# EAGLE design delete-me (EAGLE 5.11)
DRAWN_BY: Alexios; PROJECT_NAME: CFT Mini-Computer; REVISION: Rev B; SHEET_DESCRIPTION: Major Registers: Program Counter (PC); SIMULATION_FILENAME: register.v#reg_pc; URL: http://www.bedroomlan.org/cft

## Sheet 1 of 3
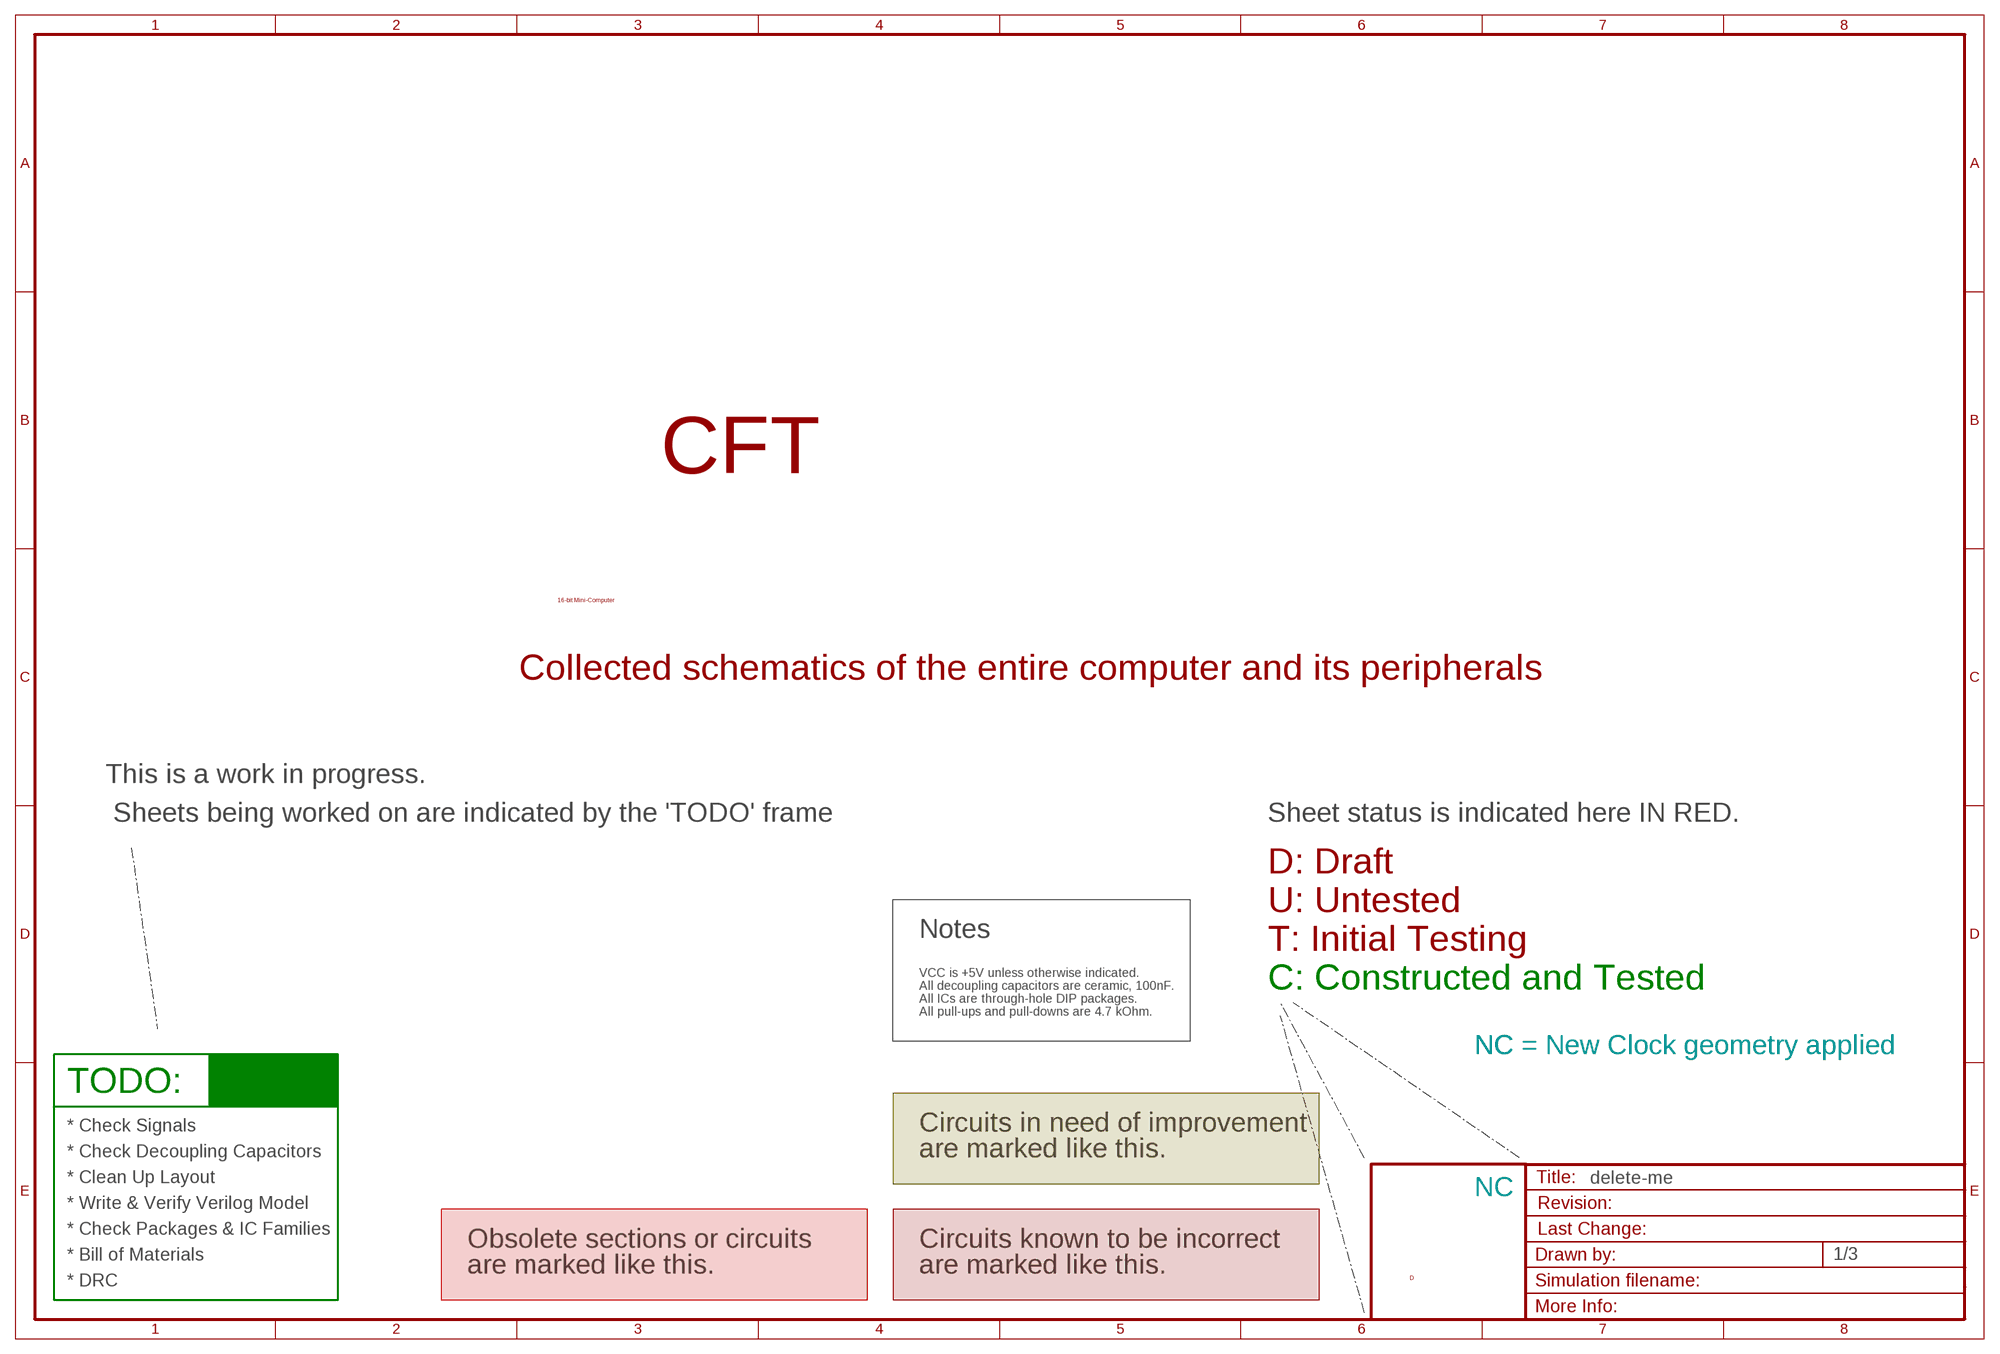
[diagram p0: schematic, sheet 1]

### Notes on the sheet
- CFT
- 16-bit Mini-Computer
- Collected schematics of the entire computer and its peripherals
- This is a work in progress.
- Sheets being worked on are indicated by the 'TODO' frame | Sheet status is indicated here IN RED.
- D: Draft
- U: Untested
- Notes
- T: Initial Testing
- VCC is +5V unless otherwise indicated.
- All decoupling capacitors are ceramic, 100nF. | C: Constructed and Tested
- All ICs are through-hole DIP packages.
- All pull-ups and pull-downs are 4.7 kOhm.
- NC | NC = New Clock geometry applied
- TODO:
- * Check Signals | Circuits in need of improvement
- * Check Decoupling Capacitors | are marked like this.
- * Clean Up Layout
- NC
- * Write & Verify Verilog Model
- * Check Packages & IC Families
- Obsolete sections or circuits | Circuits known to be incorrect
- * Bill of Materials
- are marked like this. | are marked like this.
- D
- * DRC

## Sheet 2 of 3
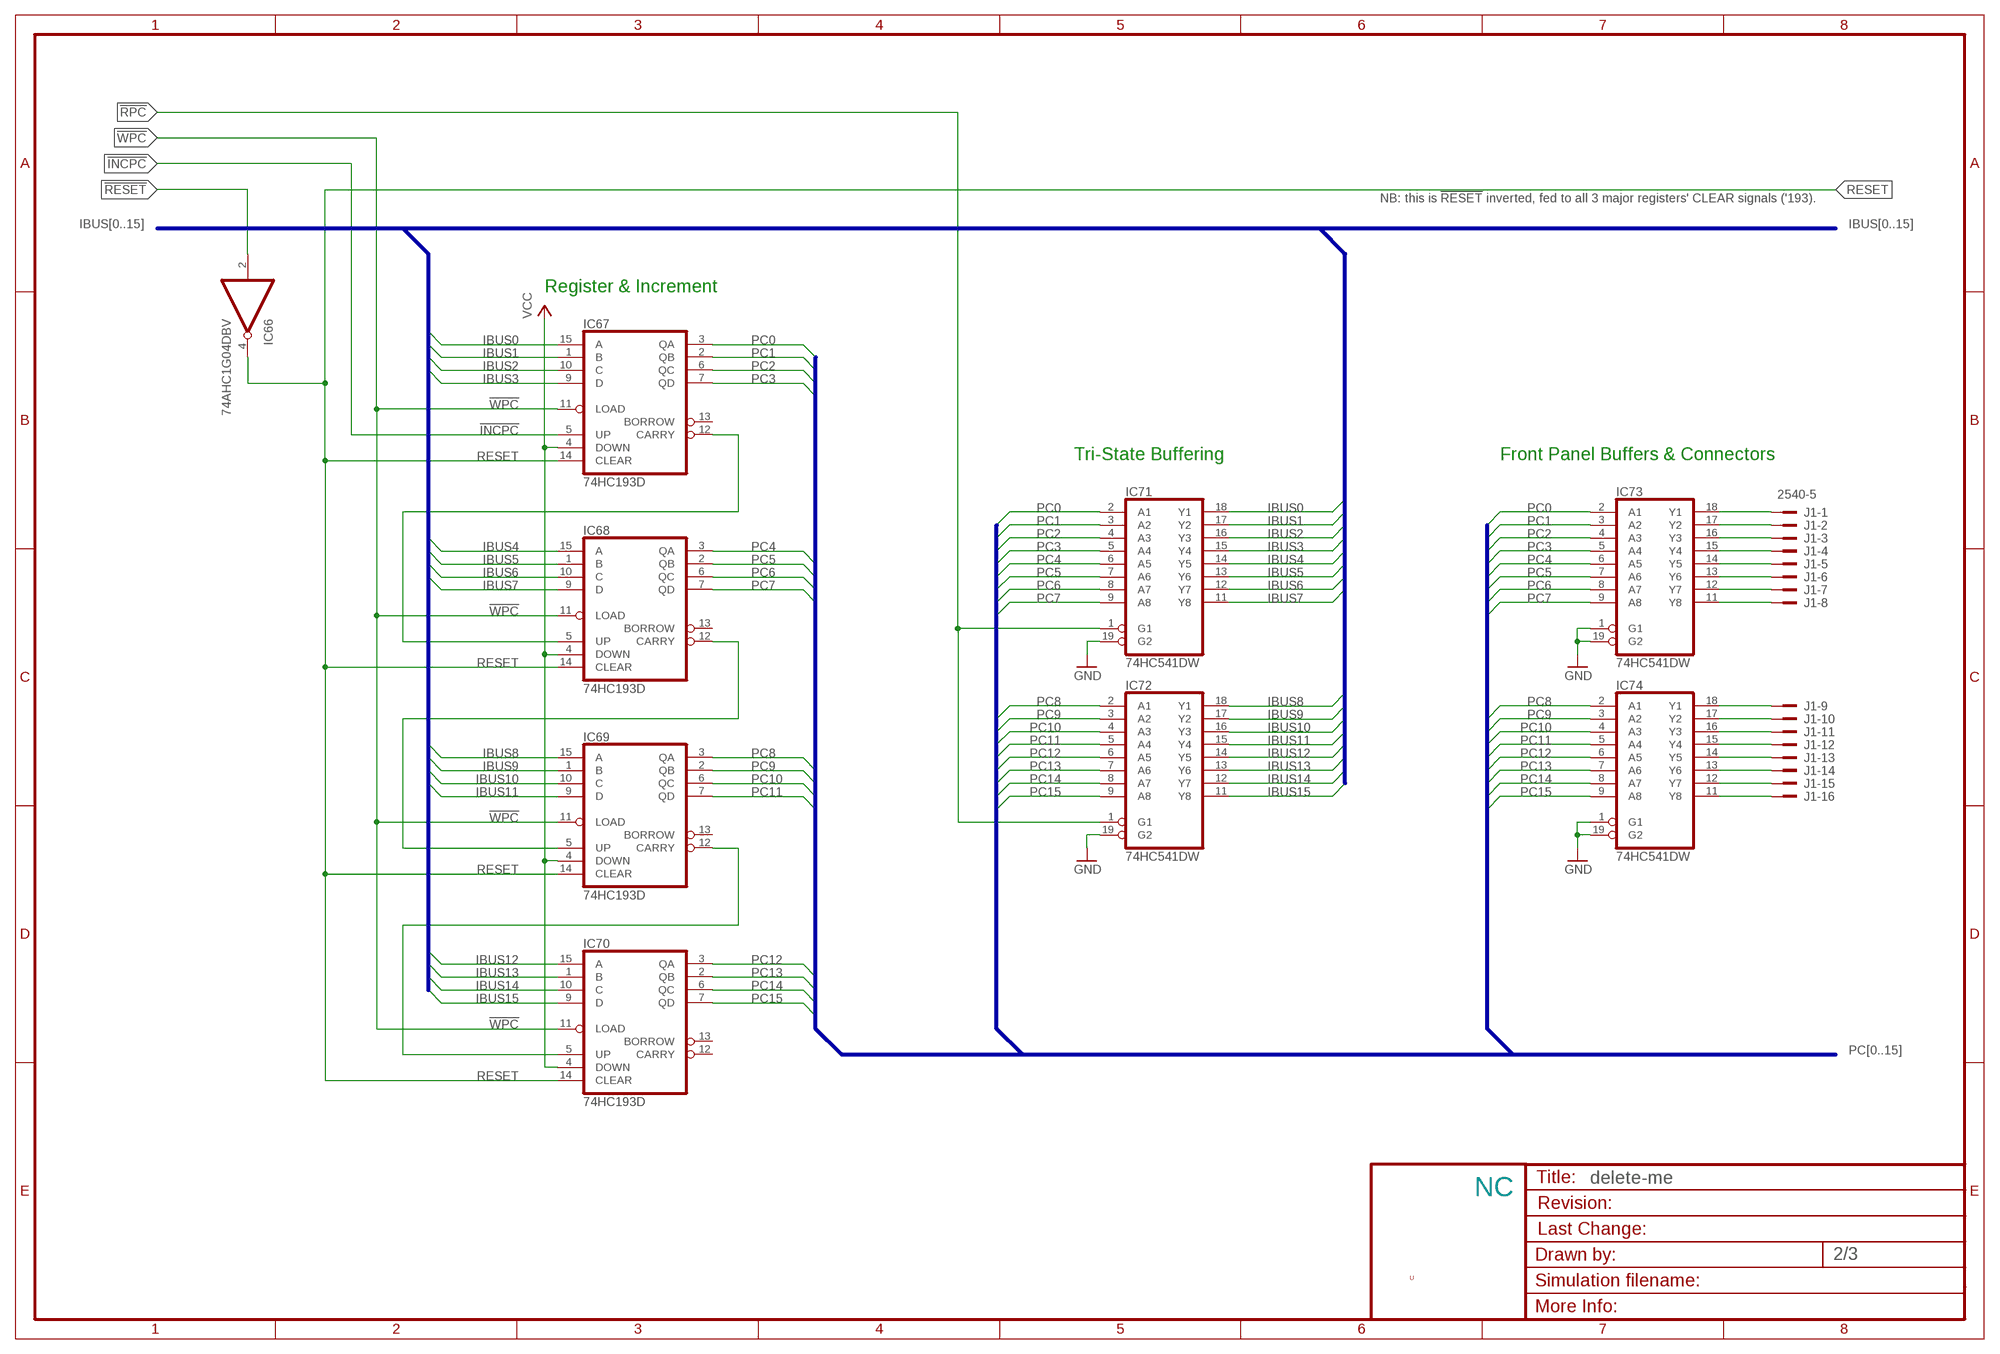
[diagram p1: schematic, sheet 2]

### Parts
IC66  74AHC1G04DBV  [SOT23-5]
IC67  74HC193D  [SO16D]
IC68  74HC193D  [SO16D]
IC69  74HC193D  [SO16D]
IC70  74HC193D  [SO16D]
IC71  74HC541DW  [SO20W]
IC72  74HC541DW  [SO20W]
IC73  74HC541DW  [SO20W]
IC74  74HC541DW  [SO20W]
J1  2540-5  [PAK100/2500-5-40]

### Nets
!INCPC: IC67.5(UP) ; also sheet 3
!RESET: IC66.2(I) ; also sheet 3
!RPC: IC71.1(G1) IC72.1(G1) ; also sheet 3
!WPC: IC67.11(LOAD) IC68.11(LOAD) IC69.11(LOAD) IC70.11(LOAD) ; also sheet 3
GND [low power]: IC71.19(G2) IC72.19(G2) IC73.1(G1) IC73.19(G2) IC74.1(G1) IC74.19(G2) ; also sheet 3
IBUS0: IC67.15(A) IC71.18(Y1) ; also sheet 3
IBUS1: IC67.1(B) IC71.17(Y2) ; also sheet 3
IBUS2: IC67.10(C) IC71.16(Y3) ; also sheet 3
IBUS3: IC67.9(D) IC71.15(Y4) ; also sheet 3
IBUS4: IC68.15(A) IC71.14(Y5) ; also sheet 3
IBUS5: IC68.1(B) IC71.13(Y6) ; also sheet 3
IBUS6: IC68.10(C) IC71.12(Y7) ; also sheet 3
IBUS7: IC68.9(D) IC71.11(Y8) ; also sheet 3
IBUS8: IC69.15(A) IC72.18(Y1) ; also sheet 3
IBUS9: IC69.1(B) IC72.17(Y2) ; also sheet 3
IBUS10: IC69.10(C) IC72.16(Y3) ; also sheet 3
IBUS11: IC69.9(D) IC72.15(Y4) ; also sheet 3
IBUS12: IC70.15(A) IC72.14(Y5) ; also sheet 3
IBUS13: IC70.1(B) IC72.13(Y6) ; also sheet 3
IBUS14: IC70.10(C) IC72.12(Y7) ; also sheet 3
IBUS15: IC70.9(D) IC72.11(Y8) ; also sheet 3
N$70: IC67.12(CARRY) IC68.5(UP)
N$71: IC68.12(CARRY) IC69.5(UP)
N$734: IC69.12(CARRY) IC70.5(UP)
N$736: IC73.18(Y1) J1.1
N$737: IC73.17(Y2) J1.2
N$738: IC73.16(Y3) J1.3
N$740: IC73.15(Y4) J1.4
N$741: IC73.14(Y5) J1.5
N$742: IC73.13(Y6) J1.6
N$743: IC73.12(Y7) J1.7
N$744: IC73.11(Y8) J1.8
N$745: IC74.18(Y1) J1.9
N$746: IC74.17(Y2) J1.10
N$747: IC74.16(Y3) J1.11
N$748: IC74.15(Y4) J1.12
N$749: IC74.14(Y5) J1.13
N$750: IC74.13(Y6) J1.14
N$751: IC74.12(Y7) J1.15
N$752: IC74.11(Y8) J1.16
PC0: IC67.3(QA) IC71.2(A1) IC73.2(A1)
PC1: IC67.2(QB) IC71.3(A2) IC73.3(A2)
PC2: IC67.6(QC) IC71.4(A3) IC73.4(A3)
PC3: IC67.7(QD) IC71.5(A4) IC73.5(A4)
PC4: IC68.3(QA) IC71.6(A5) IC73.6(A5)
PC5: IC68.2(QB) IC71.7(A6) IC73.7(A6)
PC6: IC68.6(QC) IC71.8(A7) IC73.8(A7)
PC7: IC68.7(QD) IC71.9(A8) IC73.9(A8)
PC8: IC69.3(QA) IC72.2(A1) IC74.2(A1)
PC9: IC69.2(QB) IC72.3(A2) IC74.3(A2)
PC10: IC69.6(QC) IC72.4(A3) IC74.4(A3) ; also sheet 3
PC11: IC69.7(QD) IC72.5(A4) IC74.5(A4) ; also sheet 3
PC12: IC70.3(QA) IC72.6(A5) IC74.6(A5) ; also sheet 3
PC13: IC70.2(QB) IC72.7(A6) IC74.7(A6) ; also sheet 3
PC14: IC70.6(QC) IC72.8(A7) IC74.8(A7) ; also sheet 3
PC15: IC70.7(QD) IC72.9(A8) IC74.9(A8) ; also sheet 3
RESET: IC66.4(O) IC67.14(CLEAR) IC68.14(CLEAR) IC69.14(CLEAR) IC70.14(CLEAR)
VCC [low power]: IC67.4(DOWN) IC68.4(DOWN) IC69.4(DOWN) IC70.4(DOWN) ; also sheet 3
Unconnected: IC67.13(BORROW) IC68.13(BORROW) IC69.13(BORROW) IC70.12(CARRY) IC70.13(BORROW) J1.17 J1.18 J1.19 J1.20 J1.21 J1.22 J1.23 J1.24 J1.25 J1.26 J1.27 J1.28 J1.29 J1.30 J1.31 J1.32

### Buses
IBUS[0..15]
PC[0..15]

### Notes on the sheet
- NB: this is !RESET! inverted, fed to all 3 major registers' CLEAR signals ('193).
- Register & Increment
- Tri-State Buffering | Front Panel Buffers & Connectors
- NC
- U

## Sheet 3 of 3
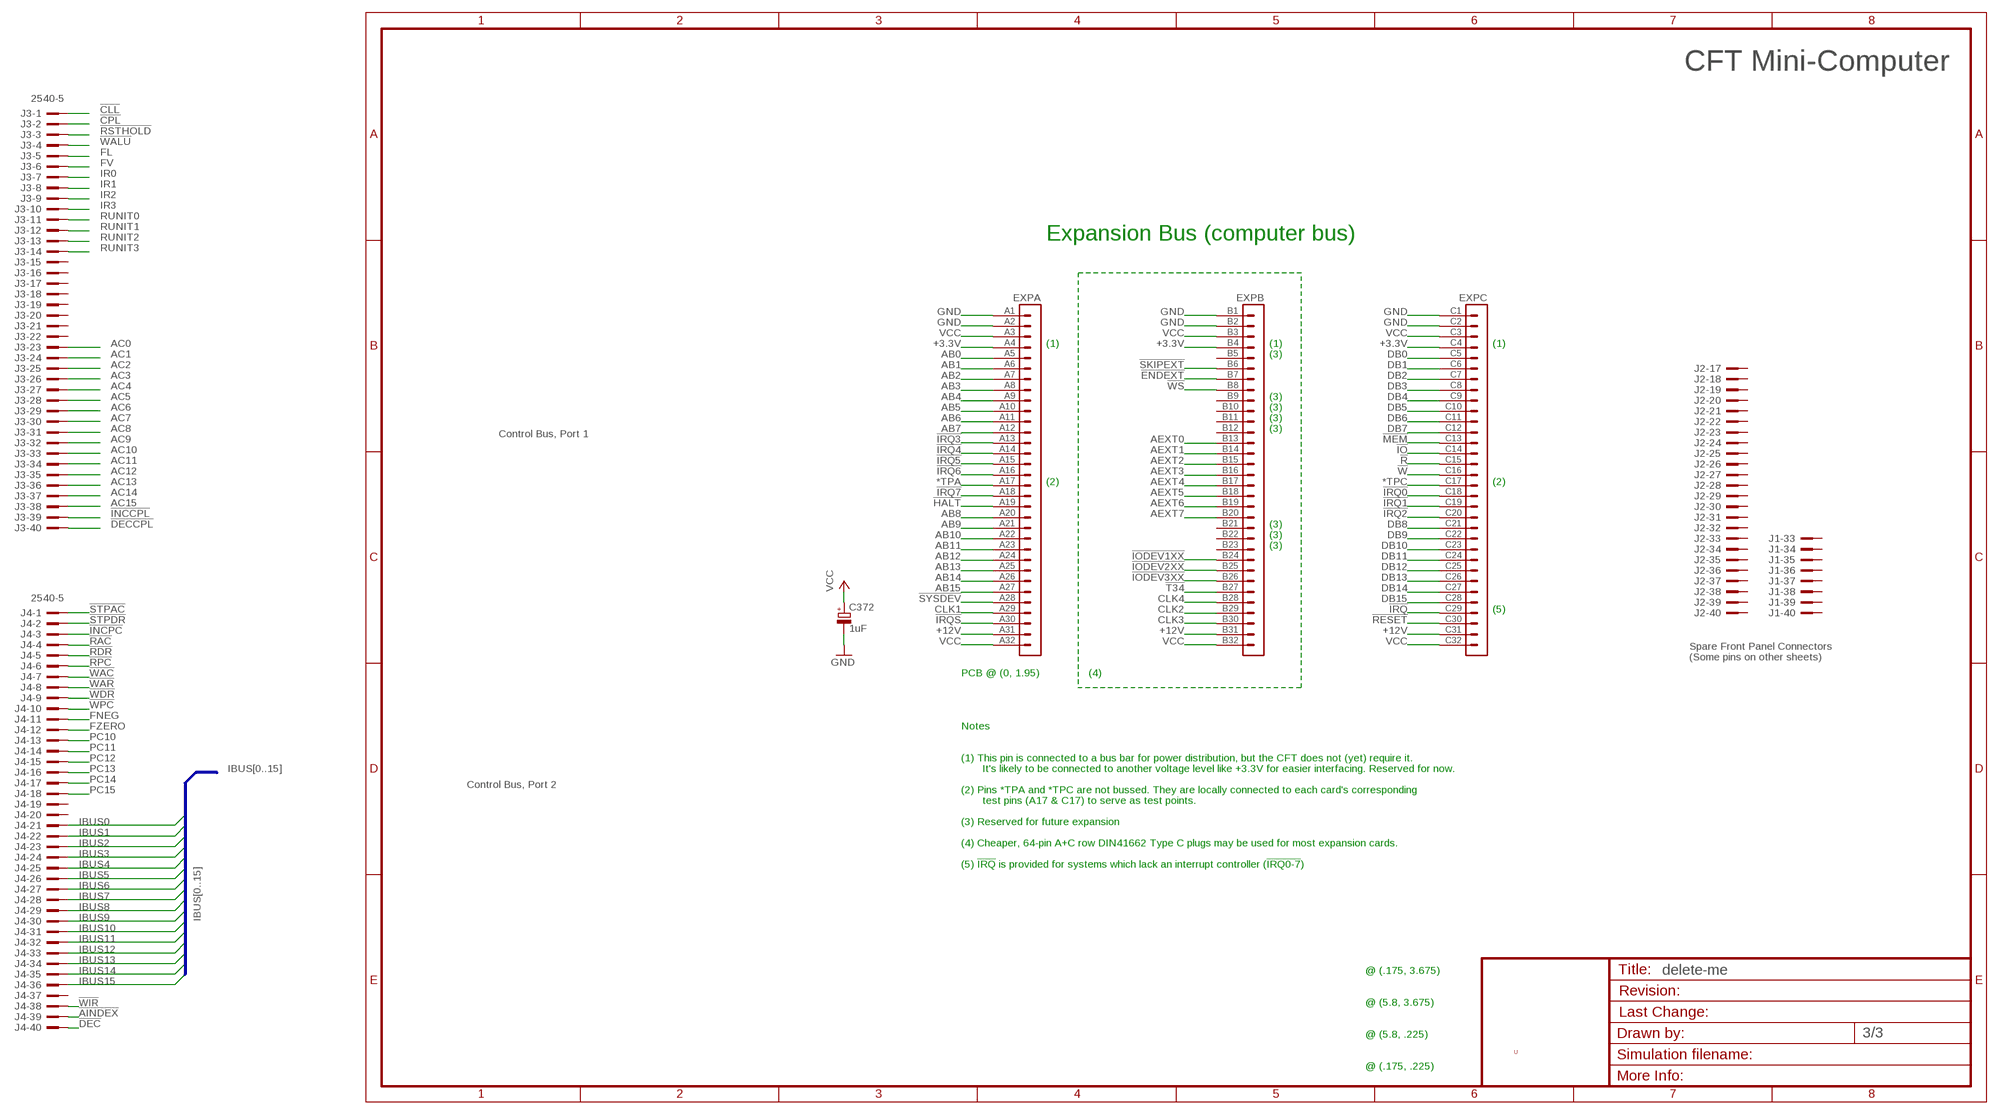
[diagram p2: schematic, sheet 3]

### Parts
C372  1uF  CPOL-EUE2.5-5  [E2,5-5]
EXP  VG96-3K  [VG96K]
J2  2540-5  [PAK100/2500-5-40]
J3  2540-5  [PAK100/2500-5-40]
J4  2540-5  [PAK100/2500-5-40]

### Nets
!AINDEX: J4.39
!CLL: J3.1
!CPL: J3.2
!DEC: J4.40
!DECCPL: J3.40
!ENDEXT: EXP.B7
!HALT: EXP.A19
!INCCPL: J3.39
!INCPC: J4.3 ; also sheet 2
!IO: EXP.C14
!IODEV1XX: EXP.B24
!IODEV2XX: EXP.B25
!IODEV3XX: EXP.B26
!IRQ: EXP.C29
!IRQ0: EXP.C18
!IRQ1: EXP.C19
!IRQ2: EXP.C20
!IRQ3: EXP.A13
!IRQ4: EXP.A14
!IRQ5: EXP.A15
!IRQ6: EXP.A16
!IRQ7: EXP.A18
!IRQS: EXP.A30
!MEM: EXP.C13
!R: EXP.C15
!RAC: J4.4
!RDR: J4.5
!RESET: EXP.C30 ; also sheet 2
!RPC: J4.6 ; also sheet 2
!RSTHOLD: J3.3
!SKIPEXT: EXP.B6
!STPAC: J4.1
!STPDR: J4.2
!SYSDEV: EXP.A28
!T34: EXP.B27
!W: EXP.C16
!WAC: J4.7
!WALU: J3.4
!WAR: J4.8
!WDR: J4.9
!WIR: J4.38
!WPC: J4.10 ; also sheet 2
!WS: EXP.B8
*TPA: EXP.A17
*TPC: EXP.C17
+3.3V: EXP.A4 EXP.B4 EXP.C4
+12V [LED power]: EXP.A31 EXP.B31 EXP.C31
AB0: EXP.A5
AB1: EXP.A6
AB2: EXP.A7
AB3: EXP.A8
AB4: EXP.A9
AB5: EXP.A10
AB6: EXP.A11
AB7: EXP.A12
AB8: EXP.A20
AB9: EXP.A21
AB10: EXP.A22
AB11: EXP.A23
AB12: EXP.A24
AB13: EXP.A25
AB14: EXP.A26
AB15: EXP.A27
AC0: J3.23
AC1: J3.24
AC2: J3.25
AC3: J3.26
AC4: J3.27
AC5: J3.28
AC6: J3.29
AC7: J3.30
AC8: J3.31
AC9: J3.32
AC10: J3.33
AC11: J3.34
AC12: J3.35
AC13: J3.36
AC14: J3.37
AC15: J3.38
AEXT0: EXP.B13
AEXT1: EXP.B14
AEXT2: EXP.B15
AEXT3: EXP.B16
AEXT4: EXP.B17
AEXT5: EXP.B18
AEXT6: EXP.B19
AEXT7: EXP.B20
CLK1: EXP.A29
CLK2: EXP.B29
CLK3: EXP.B30
CLK4: EXP.B28
DB0: EXP.C5
DB1: EXP.C6
DB2: EXP.C7
DB3: EXP.C8
DB4: EXP.C9
DB5: EXP.C10
DB6: EXP.C11
DB7: EXP.C12
DB8: EXP.C21
DB9: EXP.C22
DB10: EXP.C23
DB11: EXP.C24
DB12: EXP.C25
DB13: EXP.C26
DB14: EXP.C27
DB15: EXP.C28
FL: J3.5
FNEG: J4.11
FV: J3.6
FZERO: J4.12
GND [low power]: C372.- EXP.A1 EXP.A2 EXP.B1 EXP.B2 EXP.C1 EXP.C2 ; also sheet 2
IBUS0: J4.21 ; also sheet 2
IBUS1: J4.22 ; also sheet 2
IBUS2: J4.23 ; also sheet 2
IBUS3: J4.24 ; also sheet 2
IBUS4: J4.25 ; also sheet 2
IBUS5: J4.26 ; also sheet 2
IBUS6: J4.27 ; also sheet 2
IBUS7: J4.28 ; also sheet 2
IBUS8: J4.29 ; also sheet 2
IBUS9: J4.30 ; also sheet 2
IBUS10: J4.31 ; also sheet 2
IBUS11: J4.32 ; also sheet 2
IBUS12: J4.33 ; also sheet 2
IBUS13: J4.34 ; also sheet 2
IBUS14: J4.35 ; also sheet 2
IBUS15: J4.36 ; also sheet 2
IR0: J3.7
IR1: J3.8
IR2: J3.9
IR3: J3.10
PC10: J4.13 ; also sheet 2
PC11: J4.14 ; also sheet 2
PC12: J4.15 ; also sheet 2
PC13: J4.16 ; also sheet 2
PC14: J4.17 ; also sheet 2
PC15: J4.18 ; also sheet 2
RUNIT0: J3.11
RUNIT1: J3.12
RUNIT2: J3.13
RUNIT3: J3.14
VCC [low power]: C372.+ EXP.A3 EXP.A32 EXP.B3 EXP.B32 EXP.C3 EXP.C32 ; also sheet 2
Unconnected: EXP.B5 EXP.B9 EXP.B10 EXP.B11 EXP.B12 EXP.B21 EXP.B22 EXP.B23 J1.33 J1.34 J1.35 J1.36 J1.37 J1.38 J1.39 J1.40 J2.1 J2.2 J2.3 J2.4 J2.5 J2.6 J2.7 J2.8 J2.9 J2.10 J2.11 J2.12 J2.13 J2.14 J2.15 J2.16 J2.17 J2.18 J2.19 J2.20 J2.21 J2.22 J2.23 J2.24 J2.25 J2.26 J2.27 J2.28 J2.29 J2.30 J2.31 J2.32 J2.33 J2.34 J2.35 J2.36 J2.37 J2.38 J2.39 J2.40 J3.15 J3.16 J3.17 J3.18 J3.19 J3.20 J3.21 J3.22 J4.19 J4.20 J4.37

### Buses
IBUS[0..15]

### Notes on the sheet
- CFT Mini-Computer
- Expansion Bus (computer bus)
- (1) | (1) | (1)
- (3)
- (3)
- (3)
- (3)
- (3)
- Control Bus, Port 1
- (2) | (2)
- (3)
- (3)
- (3)
- (5)
- Spare Front Panel Connectors
- (Some pins on other sheets)
- PCB @ (0, 1.95) | (4)
- Notes
- (1) This pin is connected to a bus bar for power distribution, but the CFT does not (yet) require it.
- It's likely to be connected to another voltage level like +3.3V for easier interfacing. Reserved for now.
- Control Bus, Port 2
- (2) Pins *TPA and *TPC are not bussed. They are locally connected to each card's corresponding
- test pins (A17 & C17) to serve as test points.
- (3) Reserved for future expansion
- (4) Cheaper, 64-pin A+C row DIN41662 Type C plugs may be used for most expansion cards.
- (5) !IRQ! is provided for systems which lack an interrupt controller (!IRQ0-7!)
- @ (.175, 3.675)
- @ (5.8, 3.675)
- @ (5.8, .225)
- U
- @ (.175, .225)

## Power pins joined to a net without a drawn wire
GND: IC66.3(GND) IC67.8(GND) IC68.8(GND) IC69.8(GND) IC70.8(GND) IC71.10(GND) IC72.10(GND) IC73.10(GND) IC74.10(GND)
VCC: IC66.5(VCC) IC67.16(VCC) IC68.16(VCC) IC69.16(VCC) IC70.16(VCC) IC71.20(VCC) IC72.20(VCC) IC73.20(VCC) IC74.20(VCC)

## Library data of the parts
C372 = rcl:CPOL-EU: POLARIZED CAPACITOR, European symbol
EXP = alexios-19inch:VG96-3: PCB EUROCARD, 96-pin type C/ABC, 2.54 mm
IC66 = alexios:74*1G04: INVERTER Gate
IC67-IC70 = alexios:74*193: Presettable Synchronous Binary Up/Down Counter Up/down 4-bit binary counter with load and clear inputs, and borrow and carry outputs. Farnell description: <http://uk.farnell.com/nxp/74hct193n/ic-74hct-cmos-74hct193-dip16-5v/dp/382218> Order Code: 382218 Manufacturer Part No: 74HCT193N RoHS : Yes Description: IC, 74HCT CMOS, 74HCT193, DIP16, 5V Counter Type:Binary Clock Frequency:47MHz Count Maximum:15 Supply Voltage Range:4.5V to 5.5V Logic Case Style:DIP No. of Pins:16 Operating Temperature Range:-40°C to +125°C Base Number:74 Clock Frequency Max:43MHz Count Max:16 Counter Measuring Functions:Presettable Synchronous Binary Up / Down Counter Device Marking:74HCT193 IC Generic Number:74HCT193 Logic Function Number:193 Logic IC Base Number:74193 Logic IC Family:HCT Logic IC Function:Presettable Synchronous 4bit Binary Up/Down Counter No. of Gates:1 No. of Inputs:4 Operating Temperature Max:125°C Operating Temperature Min:-40°C Package / Case:DIP Supply Voltage:5V Supply Voltage Max:5.5V Supply Voltage Min:4.5V Termination Type:Through Hole
IC71-IC74 = alexios:74*541: Octal BUFFER and LINE DRIVER, 3-state
J1-J4 = con-3m:2540-: 3M (TM) Pak 100 4-Wall Header Source: 3M; OC_FARNELL: 9838414; OC_NEWARK: unknown

## Net classes
0 default: width 0.152 mm, clearance 0.152 mm
1 low power: width 0.305 mm, clearance 0.152 mm
2 LED power: width 0.406 mm, clearance 0.254 mm

## Board
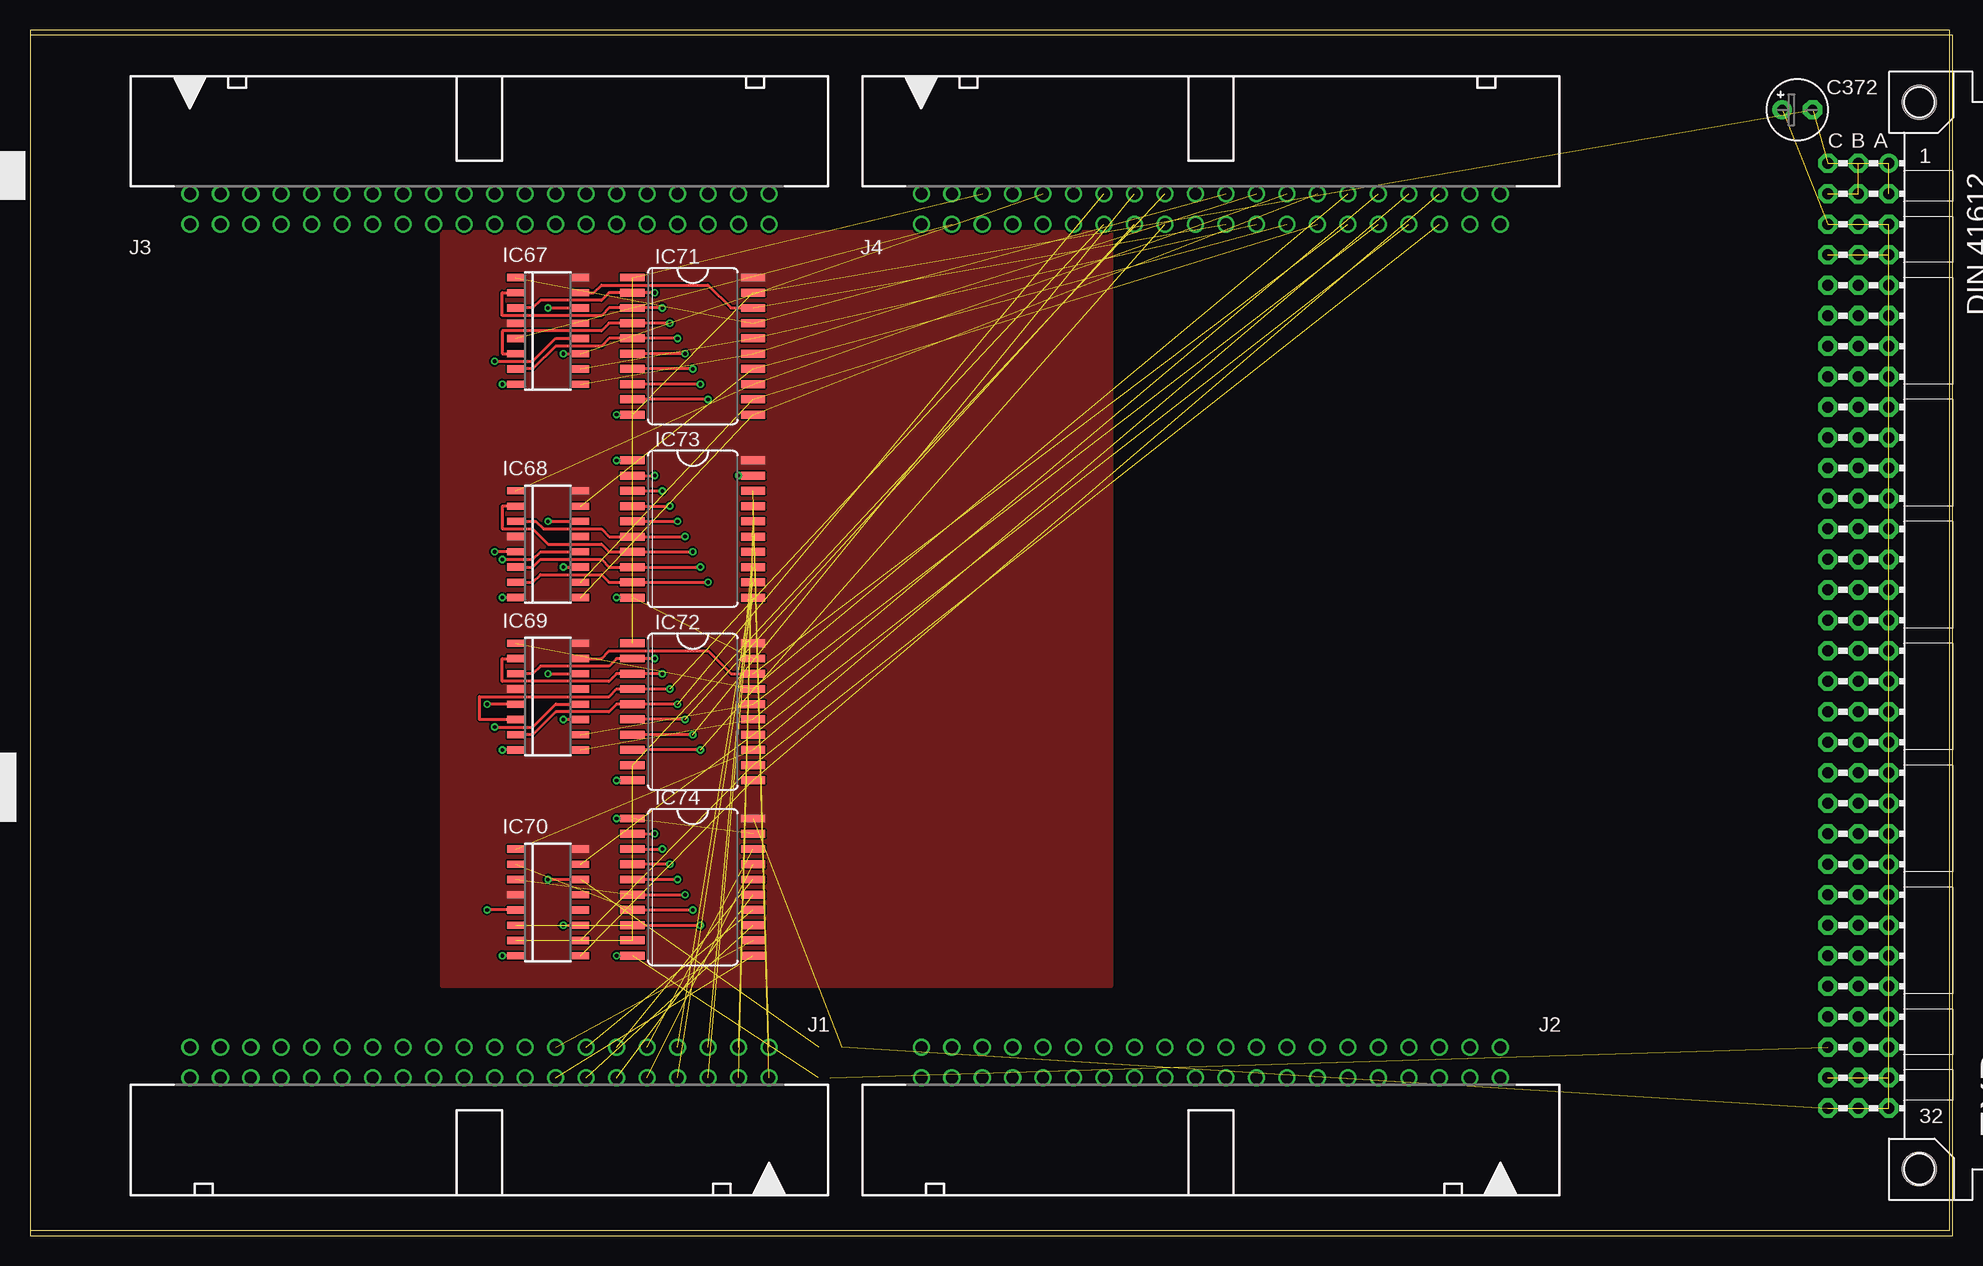
[diagram p3: board, top side]
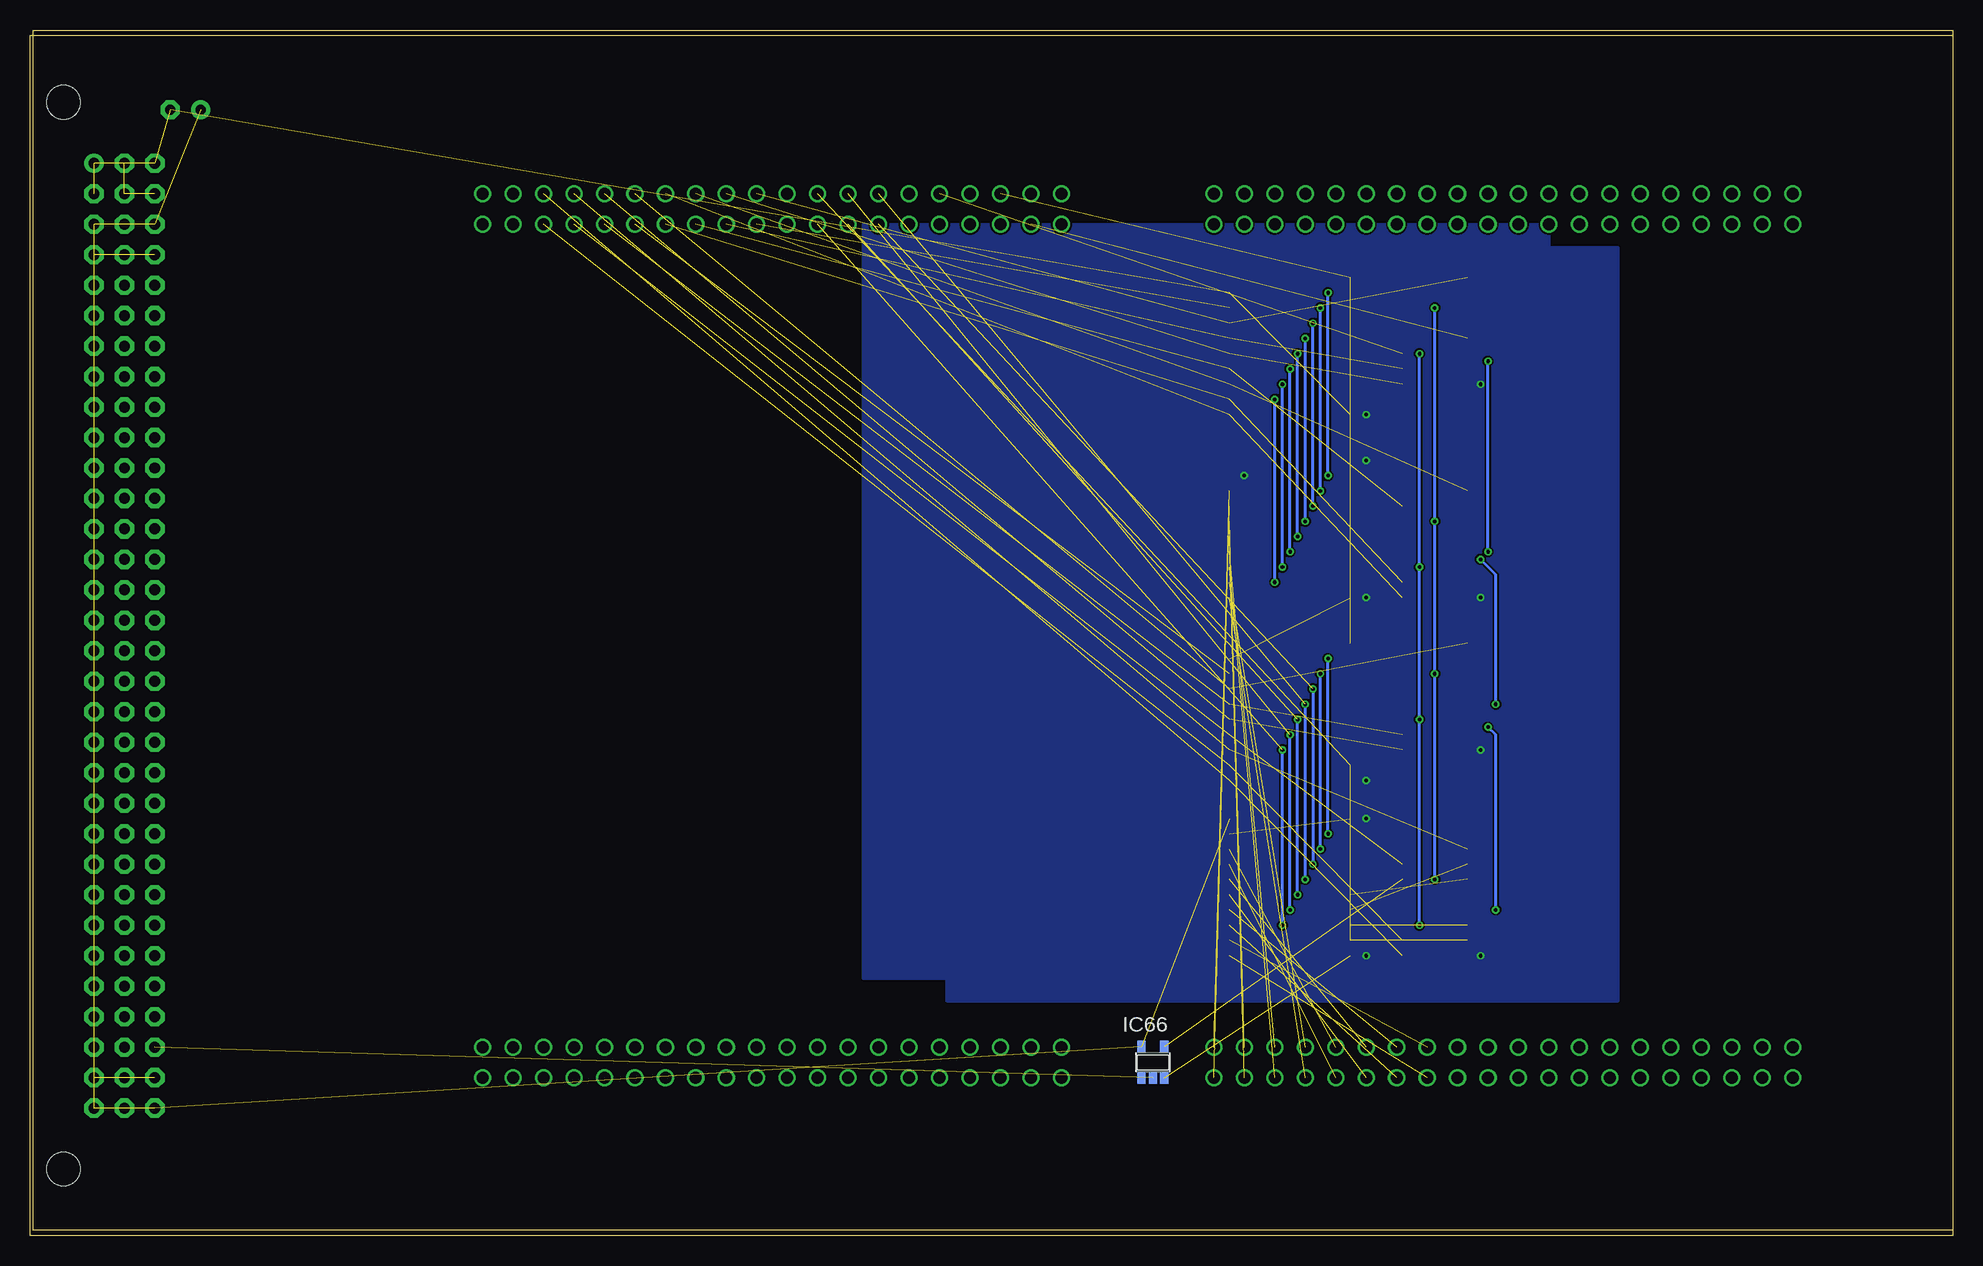
[diagram p4: board, bottom side, seen from below]

Size 160 x 100 mm. Coordinates in mm from the lower left corner, seen from the top.
Outline: 0,0 160,0 160,100 0,100 0,0
Copper layers (1*16): Top 0.035mm / dielectric 0.2mm / Bottom 0.035mm
Design rules "MyroPCB-6mil-prototyping": minimum track width 6mil, minimum drill 12mil, track to track 6mil, track to pad 6mil, pad to pad 6mil, via to via 6mil, smd to smd 6mil, copper to edge 20mil, drill to drill 8mil, minimum pad ring 6mil, minimum via ring 6mil, stop-mask expansion 4mil, vias tented up to drill 0mil, thermal gap 6mil

### Footprints (pad centres in the part's own frame; a part is rotated, then mirrored left to right if it is on the bottom)
E2,5-5 = drill 0.813 pad 1.6 round: + -1.27,0 | drill 0.813 pad 1.6 octagon: - 1.27,0
VG96K = drill 0.914 pad 1.6 round: A1 154.94,39.37 | drill 0.914 pad 1.6 octagon: A2 154.94,36.83; A3 154.94,34.29; A4 154.94,31.75; A5 154.94,29.21; A6 154.94,26.67; A7 154.94,24.13; A8 154.94,21.59; A9 154.94,19.05; A10 154.94,16.51; A11 154.94,13.97; A12 154.94,11.43; A13 154.94,8.89; A14 154.94,6.35; A15 154.94,3.81; A16 154.94,1.27; A17 154.94,-1.27; A18 154.94,-3.81; A19 154.94,-6.35; A20 154.94,-8.89; A21 154.94,-11.43; A22 154.94,-13.97; A23 154.94,-16.51; A24 154.94,-19.05; A25 154.94,-21.59; A26 154.94,-24.13; A27 154.94,-26.67; A28 154.94,-29.21; A29 154.94,-31.75; A30 154.94,-34.29; A31 154.94,-36.83; A32 154.94,-39.37; B1 152.4,39.37; B2 152.4,36.83; B3 152.4,34.29; B4 152.4,31.75; B5 152.4,29.21; B6 152.4,26.67; B7 152.4,24.13; B8 152.4,21.59; B9 152.4,19.05; B10 152.4,16.51; B11 152.4,13.97; B12 152.4,11.43; B13 152.4,8.89; B14 152.4,6.35; B15 152.4,3.81; B16 152.4,1.27; B17 152.4,-1.27; B18 152.4,-3.81; B19 152.4,-6.35; B20 152.4,-8.89; B21 152.4,-11.43; B22 152.4,-13.97; B23 152.4,-16.51; B24 152.4,-19.05; B25 152.4,-21.59; B26 152.4,-24.13; B27 152.4,-26.67; B28 152.4,-29.21; B29 152.4,-31.75; B30 152.4,-34.29; B31 152.4,-36.83; B32 152.4,-39.37; C1 149.86,39.37; C2 149.86,36.83; C3 149.86,34.29; C4 149.86,31.75; C5 149.86,29.21; C6 149.86,26.67; C7 149.86,24.13; C8 149.86,21.59; C9 149.86,19.05; C10 149.86,16.51; C11 149.86,13.97; C12 149.86,11.43; C13 149.86,8.89; C14 149.86,6.35; C15 149.86,3.81; C16 149.86,1.27; C17 149.86,-1.27; C18 149.86,-3.81; C19 149.86,-6.35; C20 149.86,-8.89; C21 149.86,-11.43; C22 149.86,-13.97; C23 149.86,-16.51; C24 149.86,-19.05; C25 149.86,-21.59; C26 149.86,-24.13; C27 149.86,-26.67; C28 149.86,-29.21; C29 149.86,-31.75; C30 149.86,-34.29; C31 149.86,-36.83; C32 149.86,-39.37 | hole 2.794: 157.48,44.45; 157.48,-44.45
SOT23-5 = smd 0.69 x 0.99: 1 -0.95,-1.29; 2 0,-1.29; 3 0.95,-1.29; 4 0.95,1.3; 5 -0.95,1.3
SO16D = smd 0.6 x 1.4: 1 -4.445,-2.715; 2 -3.175,-2.715; 3 -1.905,-2.715; 4 -0.635,-2.715; 5 0.635,-2.715; 6 1.905,-2.715; 7 3.175,-2.715; 8 4.445,-2.715; 9 4.445,2.715; 10 3.175,2.715; 11 1.905,2.715; 12 0.635,2.715; 13 -0.635,2.715; 14 -1.905,2.715; 15 -3.175,2.715; 16 -4.445,2.715
SO20W = smd 0.66 x 2.032: 1 -5.715,-5.029; 2 -4.445,-5.029; 3 -3.175,-5.029; 4 -1.905,-5.029; 5 -0.635,-5.029; 6 0.635,-5.029; 7 1.905,-5.029; 8 3.175,-5.029; 9 4.445,-5.029; 10 5.715,-5.029; 11 5.715,5.029; 12 4.445,5.029; 13 3.175,5.029; 14 1.905,5.029; 15 0.635,5.029; 16 -0.635,5.029; 17 -1.905,5.029; 18 -3.175,5.029; 19 -4.445,5.029; 20 -5.715,5.029
PAK100/2500-5-40 = drill 1 pad 1.422 round: 1 -24.13,-1.27; 2 -24.13,1.27; 3 -21.59,-1.27; 4 -21.59,1.27; 5 -19.05,-1.27; 6 -19.05,1.27; 7 -16.51,-1.27; 8 -16.51,1.27; 9 -13.97,-1.27; 10 -13.97,1.27; 11 -11.43,-1.27; 12 -11.43,1.27; 13 -8.89,-1.27; 14 -8.89,1.27; 15 -6.35,-1.27; 16 -6.35,1.27; 17 -3.81,-1.27; 18 -3.81,1.27; 19 -1.27,-1.27; 20 -1.27,1.27; 21 1.27,-1.27; 22 1.27,1.27; 23 3.81,-1.27; 24 3.81,1.27; 25 6.35,-1.27; 26 6.35,1.27; 27 8.89,-1.27; 28 8.89,1.27; 29 11.43,-1.27; 30 11.43,1.27; 31 13.97,-1.27; 32 13.97,1.27; 33 16.51,-1.27; 34 16.51,1.27; 35 19.05,-1.27; 36 19.05,1.27; 37 21.59,-1.27; 38 21.59,1.27; 39 24.13,-1.27; 40 24.13,1.27

### Placement (x,y rotation side)
C372  147.32,93.34 0 top
EXP  0,49.53 0 top
IC66  66.67,13.97 0 bottom
IC67  43.18,74.93 270 top
IC68  43.18,57.15 270 top
IC69  43.18,44.45 270 top
IC70  43.18,27.3 270 top
IC71  55.24,73.66 270 top
IC72  55.24,43.18 270 top
IC73  55.24,58.42 270 top
IC74  55.24,28.57 270 top
J1  37.47,13.97 180 top
J2  98.42,13.97 180 top
J3  37.47,85.09 0 top
J4  98.42,85.09 0 top

### Tracks (layer width: path | path; a pad name or v marks a point on that pad's centre or on a via)
!INCPC  (1 unrouted)
!RESET  (1 unrouted)
!RPC  (2 unrouted)
!WPC  (via drill 0.3)  (1 unrouted)
  Top 0.254: v44.45,73.03 IC67.11 | v44.45,55.24 IC68.11 | v44.45,42.55 IC69.11 | v44.45,25.4 IC70.11
  Bottom 0.254: v44.45,73.03 v44.45,55.24 v44.45,42.55 v44.45,25.4
+3.3V  (2 unrouted)
+12V  (2 unrouted)
GND  (via drill 0.3)  (11 unrouted)
  Top 0.254: IC67.8 v39.37,70.48 | IC71.10 v48.9,67.94 | IC73.1 v48.9,64.14 | IC73.19 v59.05,62.87 | IC68.8 v39.37,52.7 | IC73.10 v48.9,52.7 | IC69.8 v39.37,40.01 | IC72.10 v48.9,37.47 | IC74.1 v48.9,34.29 | IC70.8 v39.37,22.86 | IC74.10 v48.9,22.86
  pour Bottom (rank 6, no thermals): 27.94,81.92 27.94,19.05 83.82,19.05 83.82,81.92
  pour Bottom (rank 6, no thermals): 33.66,83.82 33.66,20.95 90.81,20.95 90.81,83.82
IBUS0  (1 unrouted)
  Top 0.254: IC67.15 46.99,78.11 47.62,78.74 56.52,78.74 58.42,76.83 IC71.18
IBUS1  (2 unrouted)
IBUS2  (2 unrouted)
IBUS3  (2 unrouted)
IBUS4  (2 unrouted)
IBUS5  (2 unrouted)
IBUS6  (2 unrouted)
IBUS7  (2 unrouted)
IBUS8  (1 unrouted)
  Top 0.254: IC69.15 47.62,47.62 48.26,48.26 56.52,48.26 58.42,46.35 IC72.18
IBUS9  (2 unrouted)
IBUS10  (2 unrouted)
IBUS11  (2 unrouted)
IBUS12  (2 unrouted)
IBUS13  (2 unrouted)
IBUS14  (2 unrouted)
IBUS15  (2 unrouted)
N$70  (via drill 0.3)
  Top 0.254: IC67.12 43.81,74.3 41.91,72.39 v38.73,72.39 | IC68.5 v38.73,56.52
  Bottom 0.254: v38.73,56.52 v38.73,72.39
N$71  (via drill 0.3)
  Top 0.254: IC68.12 42.55,56.52 41.91,55.88 v39.37,55.88 | IC69.5 v38.1,43.81
  Bottom 0.254: v38.1,43.81 38.1,54.61 v39.37,55.88
N$734  (via drill 0.3)
  Top 0.254: IC69.12 43.81,43.81 41.91,41.91 v38.73,41.91 | IC70.5 v38.1,26.67
  Bottom 0.254: v38.1,26.67 38.1,41.27 v38.73,41.91
N$736  (1 unrouted)
N$737  (1 unrouted)
N$738  (1 unrouted)
N$740  (1 unrouted)
N$741  (1 unrouted)
N$742  (1 unrouted)
N$743  (1 unrouted)
N$744  (1 unrouted)
N$745  (1 unrouted)
N$746  (1 unrouted)
N$747  (1 unrouted)
N$748  (1 unrouted)
N$749  (1 unrouted)
N$750  (1 unrouted)
N$751  (1 unrouted)
N$752  (1 unrouted)
PC0  (via drill 0.3)
  Top 0.254: IC67.3 41.91,76.83 42.55,77.47 47.62,77.47 48.26,78.11 IC71.2 v52.07,78.11 | IC73.2 v52.07,62.87
  Bottom 0.254: v52.07,62.87 v52.07,78.11
PC1  (via drill 0.3)
  Top 0.254: IC67.2 39.37,78.11 39.37,76.2 47.62,76.2 48.26,76.83 IC71.3 v52.7,76.83 | IC73.3 v52.7,61.59
  Bottom 0.254: v52.7,61.59 v52.7,76.83
PC2  (via drill 0.3)
  Top 0.254: IC67.6 39.37,73.03 39.37,74.93 47.62,74.93 48.26,75.56 IC71.4 v53.34,75.56 | IC73.4 v53.34,60.33
  Bottom 0.254: v53.34,60.33 v53.34,75.56
PC3  (via drill 0.3)
  Top 0.254: IC67.7 41.91,71.75 43.81,73.66 47.62,73.66 48.26,74.3 IC71.5 v53.98,74.3 | IC73.5 v53.98,59.05
  Bottom 0.254: v53.98,59.05 v53.98,74.3
PC4  (via drill 0.3)
  Top 0.254: IC68.3 42.16,59.05 42.8,58.42 47.62,58.42 48.26,57.78 IC73.6 v54.61,57.78 | v54.61,73.03 IC71.6
  Bottom 0.254: v54.61,57.78 v54.61,73.03
PC5  (via drill 0.3)
  Top 0.254: IC68.2 39.37,60.33 39.37,58.42 41.91,58.42 43.18,57.15 47.62,57.15 48.26,56.52 IC73.7 v55.24,56.52 | v55.24,71.75 IC71.7
  Bottom 0.254: v55.24,56.52 v55.24,71.75
PC6  (via drill 0.3)
  Top 0.254: IC68.6 41.91,55.24 42.55,55.88 47.62,55.88 48.26,55.24 IC73.8 v55.88,55.24 | v55.88,70.48 IC71.8
  Bottom 0.254: v55.88,55.24 v55.88,70.48
PC7  (via drill 0.3)
  Top 0.254: IC68.7 41.91,53.98 42.55,54.61 47.62,54.61 48.26,53.98 IC73.9 v56.52,53.98 | v56.52,69.22 IC71.9
  Bottom 0.254: v56.52,53.98 v56.52,69.22
PC8  (via drill 0.3)
  Top 0.254: v52.07,47.62 IC72.2 48.9,47.62 48.26,46.99 42.55,46.99 41.91,46.35 IC69.3 | IC74.2 v52.07,33.02
  Bottom 0.254: v52.07,33.02 v52.07,47.62
PC9  (via drill 0.3)
  Top 0.254: v52.7,46.35 IC72.3 48.9,46.35 48.26,45.72 39.37,45.72 39.37,47.62 IC69.2 | IC74.3 v52.7,31.75
  Bottom 0.254: v52.7,31.75 v52.7,46.35
PC10  (via drill 0.3)  (1 unrouted)
  Top 0.254: v53.34,45.09 IC72.4 48.9,45.09 48.26,44.45 37.47,44.45 37.47,42.55 IC69.6 | v53.34,30.48 IC74.4
  Bottom 0.254: v53.34,45.09 v53.34,30.48
PC11  (via drill 0.3)  (1 unrouted)
  Top 0.254: v53.98,43.81 IC72.5 48.9,43.81 48.26,43.18 43.81,43.18 41.91,41.27 IC69.7 | IC74.5 v53.98,29.21
  Bottom 0.254: v53.98,29.21 v53.98,43.81
PC12  (via drill 0.3)  (2 unrouted)
  Top 0.254: v54.61,42.55 IC72.6 | IC74.6 v54.61,27.94
  Bottom 0.254: v54.61,27.94 v54.61,42.55
PC13  (via drill 0.3)  (2 unrouted)
  Top 0.254: IC74.7 v55.24,26.67 | v55.24,41.27 IC72.7
  Bottom 0.254: v55.24,26.67 v55.24,41.27
PC14  (via drill 0.3)  (2 unrouted)
  Top 0.254: v55.88,40.01 IC72.8 | IC74.8 v55.88,25.4
  Bottom 0.254: v55.88,25.4 v55.88,40.01
PC15  (3 unrouted)
RESET  (via drill 0.3)  (1 unrouted)
  Top 0.254: v43.18,76.83 IC67.14 | v43.18,59.05 IC68.14 | v43.18,46.35 IC69.14 | v43.18,29.21 IC70.14
  Bottom 0.254: v43.18,76.83 v43.18,59.05 v43.18,46.35 v43.18,29.21
VCC  (8 unrouted)
  pour Top (rank 6, no thermals): 34.29,83.19 34.29,20.32 90.17,20.32 90.17,83.19